# Altium schematic sheet Switch1.SchDoc
size A; SheetNumber: 4; SheetTotal: 12
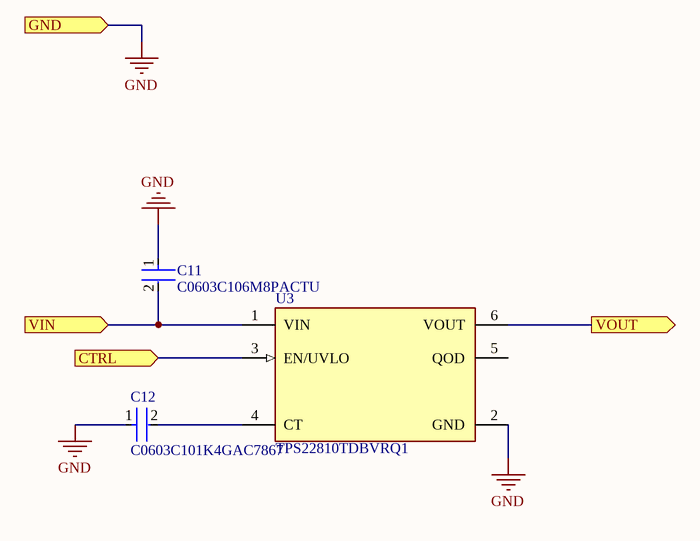
[diagram p0: Switch1.SchDoc]

## Parts
C11  C0603C106M8PACTU  [FP-C0603C106M8PACTU-MFG]
C12  C0603C101K4GAC7867  [FP-C0603C-CF-MFG]
U3  TPS22810TDBVRQ1  [FP-DBV0006A-MFG]

## Ports
CTRL (in), GND (in), VIN (in), VOUT (out)

## Nets
GND: C11.1 C12.1 U3.2(GND) ; port GND
CTRL: U3.3(EN/UVLO) ; port CTRL
VIN: C11.2 U3.1(VIN) ; port VIN
VOUT: U3.6(VOUT) ; port VOUT
NetC12_2: C12.2 U3.4(CT)

Not connected (* = marked no-connect by the designer): U3 5(QOD)

## Library data of the parts
C11 = CMP-03020-034654-1: CAP CER 10UF 10V X5R 0603; RoHS Compliant: Yes
C12 = CMP-03020-014723-2: CAP CER 100PF 16V NP0 0603; Manufacturer: KEMET; Automotive Grade: Grade 1; Material: Ceramic; Temperature Characteristic: C0G; Temperature Coefficient: 30ppm/°C; Tolerance: 0.1; Category: Cap; Temperature Range High: +125°C; RoHS: TRUE; Device Class L2: Capacitors; Automotive: Yes; Height: 0.87mm; Value: 100 pF; ComponentLink2Description: Datasheet; Digikey Description: CAP CER 100PF 16V NP0 0603; Manufacturer Part Number: C0603C101K4GAC7867; ComponentLink2URL: https://api.kemet.com/component-edge/download/datasheet/C0603C100J5GACAUTO.pdf; Device Class L1: Passive Components; Device Class L3: Ceramic Capacitors; Temperature: -55°C to +125°C; Lead Free: Yes; Capacitance: 100 pF; Temperature Range Low: -55°C; Voltage Rating: 16 V; Package: C0603C-CF; Octopart: https://octopart.com/c0603c101k4gac7867-kemet-1494535
U3 = CMP-04910-000007-2: IC PWR SWITCH N-CHAN 1:1 SOT23-6; Max Output Current: 2A; Max Supply Voltage: 18V; Min Supply Voltage: 2.7V; Number of Outputs: 1; Output Configuration: High Side; Fault Protection: Over Temperature; Interface: On/Off; Weight: 0.000801oz; Case/Package: SOT-23-6; Series: TPS22810-Q1; Package Quantity: 3000; RoHS Compliant: Yes; Number of Channels: 1; Max Operating Temperature: 105°C; Packaging: Cut Tape; Min Operating Temperature: -40°C